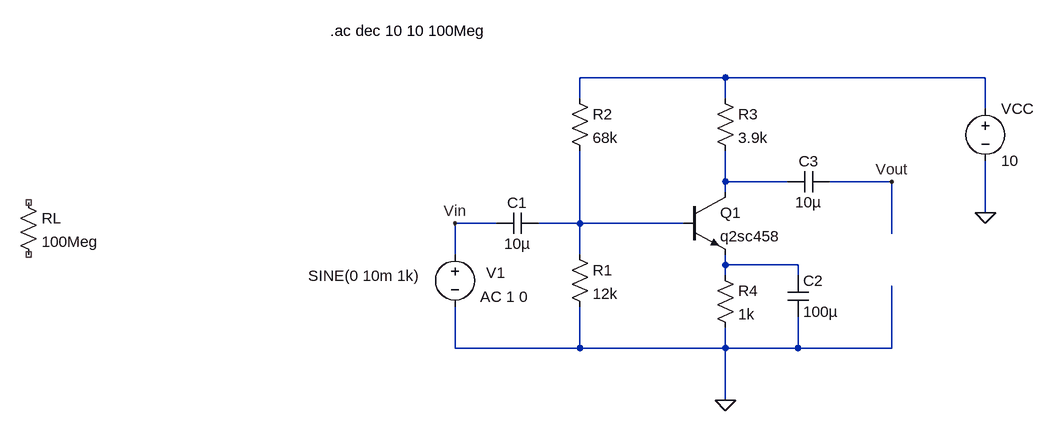
[diagram p0: schematic 1-1.asc]
1-1.asc, the LTspice schematic file:
Version 4
SHEET 1 920 680
WIRE 448 -144 224 -144
WIRE 848 -144 448 -144
WIRE 224 -112 224 -144
WIRE 448 -112 448 -144
WIRE 848 -96 848 -144
WIRE 448 16 448 -32
WIRE 544 16 448 16
WIRE 704 16 608 16
WIRE 448 32 448 16
WIRE 848 64 848 -16
WIRE 96 80 32 80
WIRE 224 80 224 -32
WIRE 224 80 160 80
WIRE 384 80 224 80
WIRE 704 96 704 16
WIRE 32 128 32 80
WIRE 224 128 224 80
WIRE 448 144 448 128
WIRE 560 144 448 144
WIRE 448 160 448 144
WIRE 560 160 560 144
WIRE 32 272 32 208
WIRE 224 272 224 208
WIRE 224 272 32 272
WIRE 448 272 448 240
WIRE 448 272 224 272
WIRE 560 272 560 224
WIRE 560 272 448 272
WIRE 704 272 704 176
WIRE 704 272 560 272
WIRE 448 352 448 272
FLAG 448 352 0
FLAG 848 64 0
FLAG 32 80 Vin
FLAG 704 16 Vout
SYMBOL voltage 32 112 R0
WINDOW 3 -226 49 Left 2
WINDOW 123 39 81 Left 2
WINDOW 39 0 0 Left 0
WINDOW 0 48 44 Left 2
SYMATTR Value SINE(0 10m 1k)
SYMATTR Value2 AC 1 0
SYMATTR InstName V1
SYMBOL cap 160 64 R90
WINDOW 0 0 32 VBottom 2
WINDOW 3 32 32 VTop 2
SYMATTR InstName C1
SYMATTR Value 10µ
SYMBOL res 208 112 R0
SYMATTR InstName R1
SYMATTR Value 12k
SYMBOL res 208 -128 R0
SYMATTR InstName R2
SYMATTR Value 68k
SYMBOL res 432 -128 R0
SYMATTR InstName R3
SYMATTR Value 3.9k
SYMBOL npn 384 32 R0
SYMATTR InstName Q1
SYMATTR Value q2sc458
SYMBOL res 432 144 R0
SYMATTR InstName R4
SYMATTR Value 1k
SYMBOL cap 544 160 R0
SYMATTR InstName C2
SYMATTR Value 100µ
SYMBOL res -640 32 R0
SYMATTR InstName RL
SYMATTR Value 100Meg
SYMBOL cap 608 0 R90
WINDOW 0 0 32 VBottom 2
WINDOW 3 32 32 VTop 2
SYMATTR InstName C3
SYMATTR Value 10µ
SYMBOL voltage 848 -112 R0
SYMATTR InstName VCC
SYMATTR Value 10
TEXT -160 -216 Left 2 !.ac dec 10 10 100Meg

The netlist it stands for:
* 1-1.asc
V1 Vin 0 SINE(0 10m 1k) AC 1 0
C1 N003 Vin 10µ
R1 N003 0 12k
R2 N001 N003 68k
R3 N001 N002 3.9k
Q1 N002 N003 N004 0 q2sc458
R4 N004 0 1k
C2 N004 0 100µ
RL NC_01 NC_02 100Meg
C3 Vout N002 10µ
VCC N001 0 10
.model NPN NPN
.model PNP PNP
.lib standard.bjt
.ac dec 10 10 100Meg
.backanno
.end